# EasyEDA schematic SCH_555 Timer PWM Compact_2022-07-11.json
TITLE: Sheet_1; REV: 1.0; Date: 2022-07-11; Sheet: 1/1; Drawn By: limchengwei; Company: Your Company
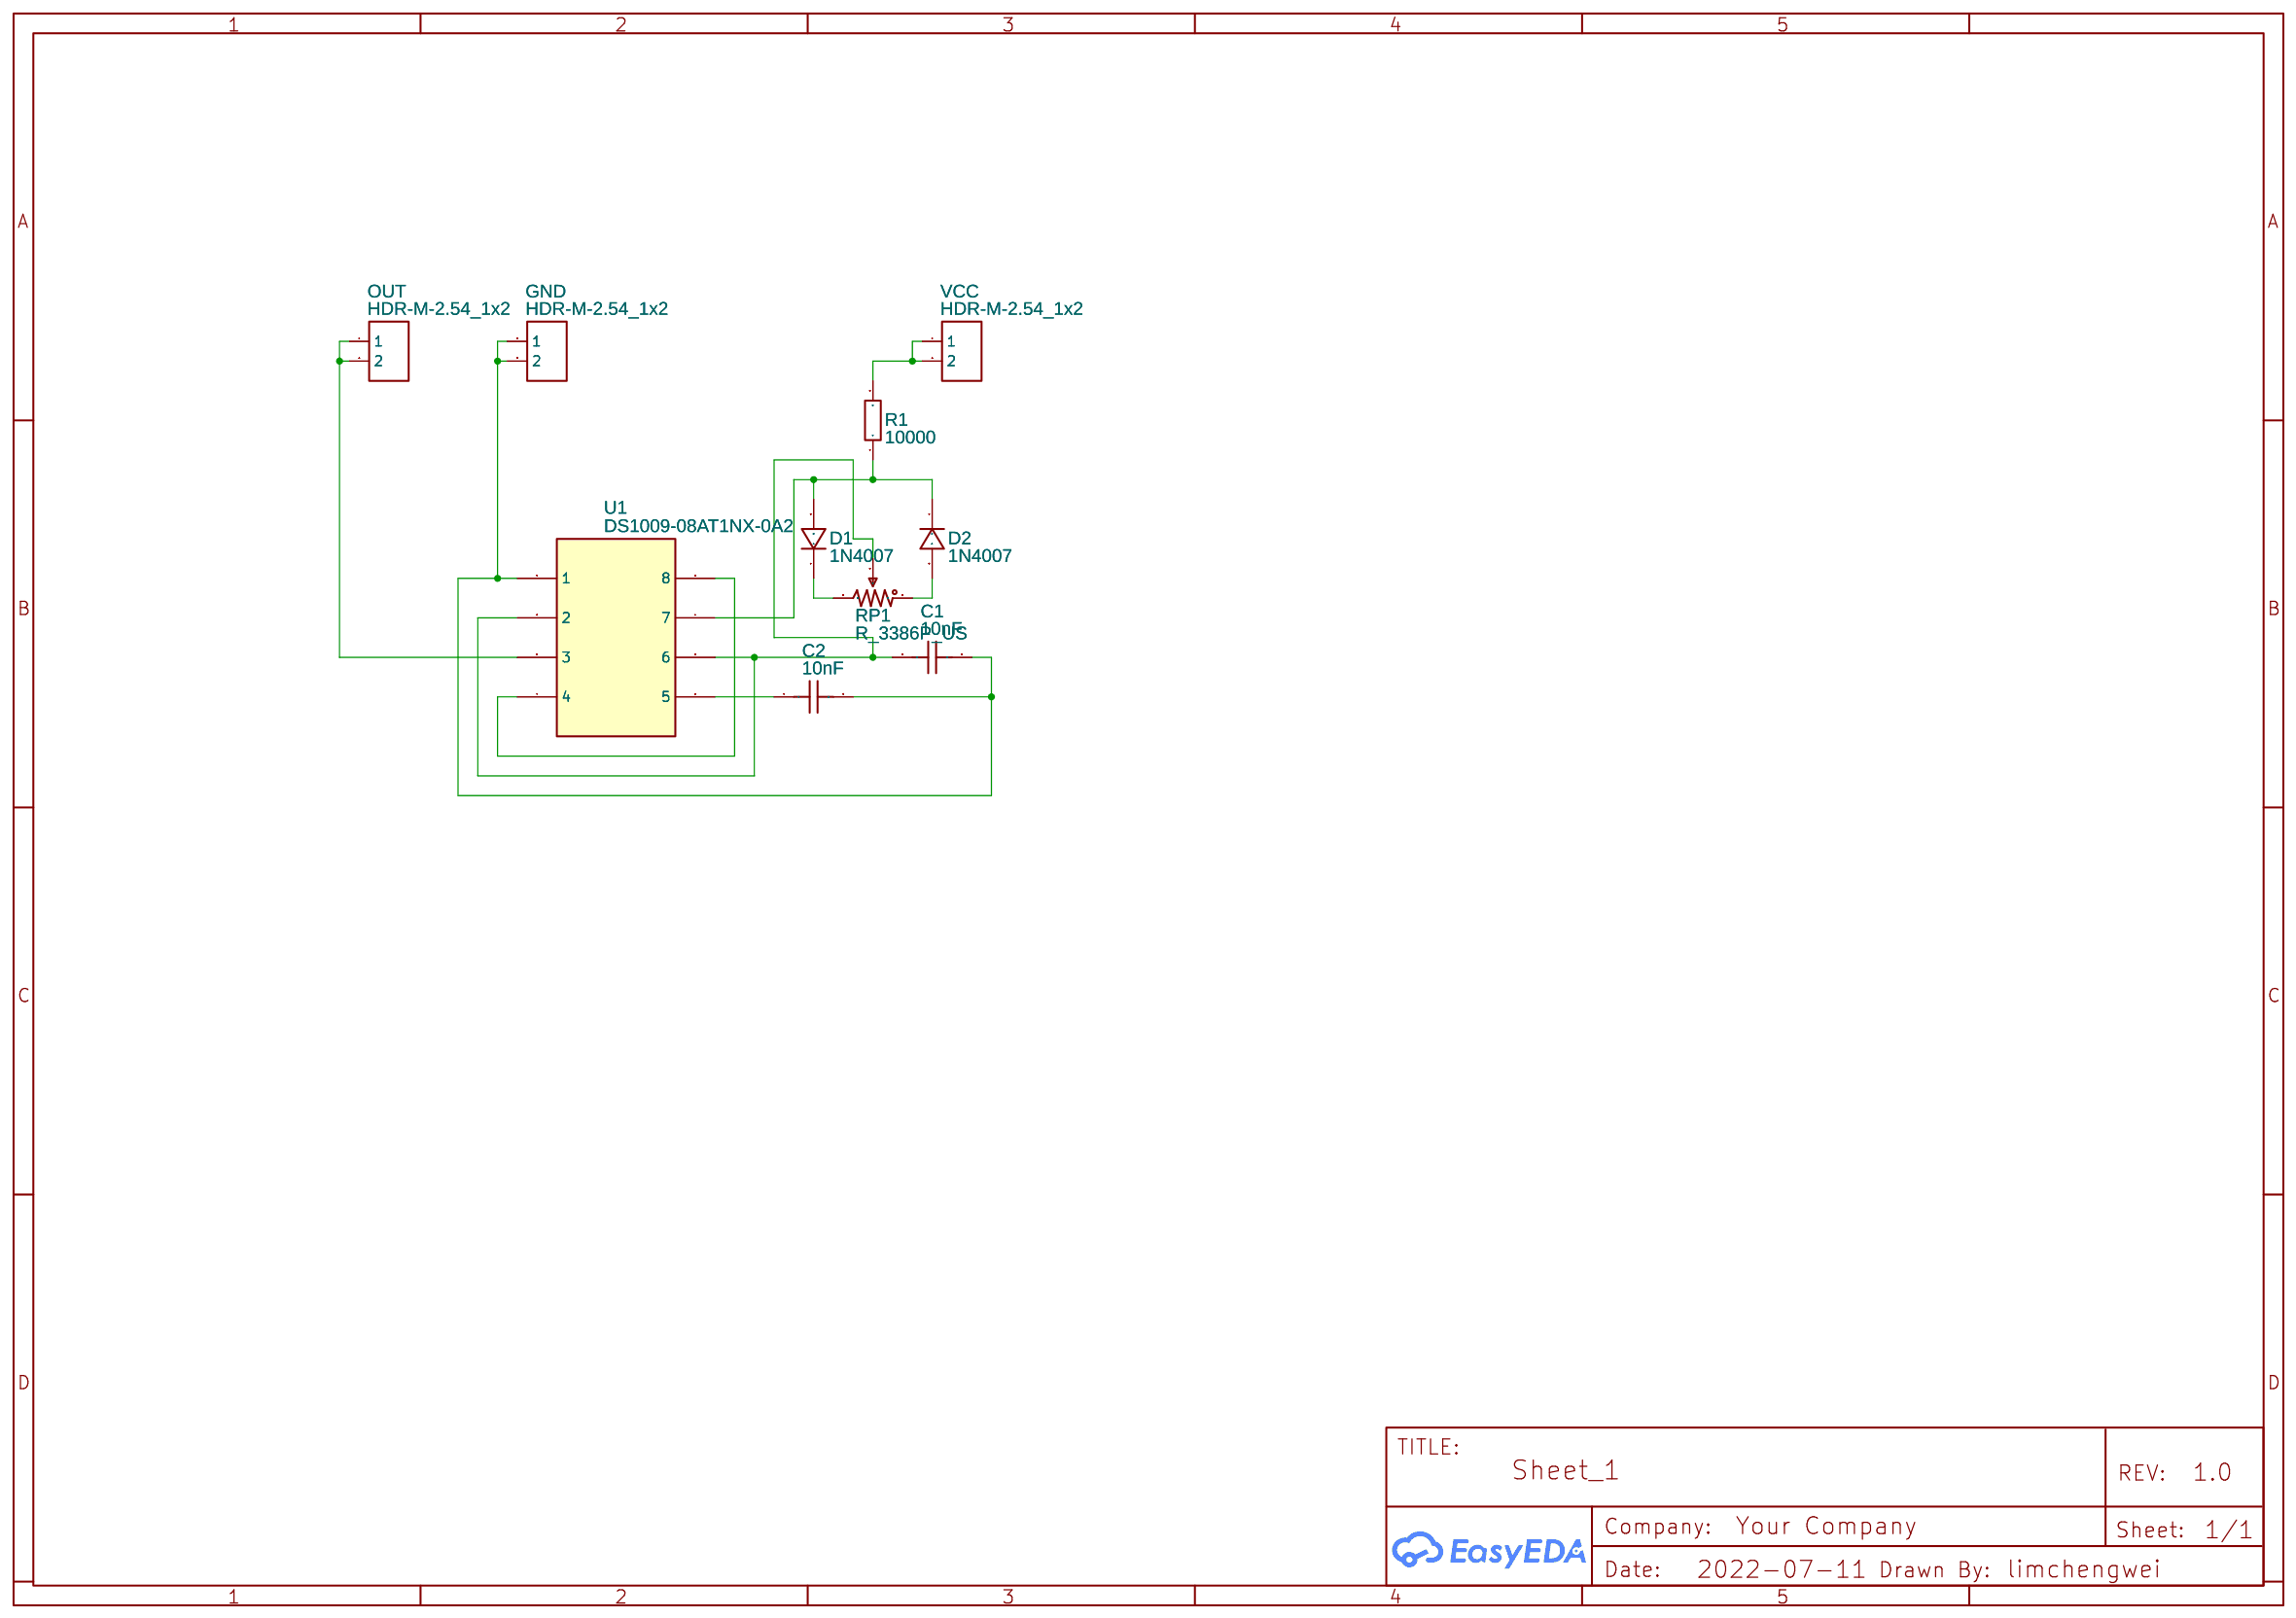
[diagram p0: schematic sheet]

## Parts
C1  10nF  [CAP-TH_L5.0-W2.2-P5.08-D0.6]
C2  10nF  [CAP-TH_L5.0-W2.2-P5.08-D0.6]
D1  1N4007  [DO-41_BD2.4-L4.7-P8.70-D0.9-RD]
D2  1N4007  [DO-41_BD2.4-L4.7-P8.70-D0.9-RD]
GND  HDR-M-2.54_1x2  [HDR-M-2.54_1X2]
OUT  HDR-M-2.54_1x2  [HDR-M-2.54_1X2]
R1  10000  [RES-TH_BD2.2-L6.5-P10.50-D0.6]
RP1  R_3386P_US  [RES-ADJ-TH_3386P]
U1  DS1009-08AT1NX-0A2  [DIP-8_L10.0-W6.5-P2.54-LS7.6-BL]
VCC  HDR-M-2.54_1x2  [HDR-M-2.54_1X2]

## Library data of the parts
C1 C2 = CC1H103MC76DB45A30S8: Supplier: LCSC; Supplier Part: C377837; Manufacturer: Dersonic(德尔创); Contributor: LCSC; JLCPCB Part Class: Extended Part
D1 D2 = 1N4007: Supplier: LCSC; Manufacturer: SEMTECH; Supplier Part: C106903; Contributor: LCEDA_Lib
GND OUT VCC = HDR-M-2.54_1x2: Supplier Part: C124375; Supplier: LCSC; Contributor: LCEDA_Lib
R1 = MF1/4W-300Ω±1% T52: Supplier: LCSC; Supplier Part: C119312; Manufacturer: Chian Chia Elec; Contributor: LCSC; JLCPCB Part Class: Extended Part; Resistance: 300Ω
RP1 = R_3386P_US: Supplier: LCSC; Contributor: LCEDA_Lib; value(Ω): 10K
U1 = DS1009-08AT1NX-0A2: Supplier: LCSC; Manufacturer: CONNFLY; Supplier Part: C72124; JLCPCB Part Class: Extended Part

## Nets
Net-(C1-1): C1.1 RP1.2 U1.2 U1.6
Net-(C1-2): C1.2 C2.2 GND.1 GND.2 U1.1
Net-(C2-1): C2.1 U1.5
Net-(D1-1): D1.1 RP1.3
Net-(D1-2): D1.2 D2.1 R1.1 U1.7
Net-(D2-2): D2.2 RP1.1
Net-(OUT-1): OUT.1 OUT.2 U1.3
Net-(R1-2): R1.2 VCC.1 VCC.2
Net-(U1-4): U1.4 U1.8
